# Altium schematic sheet Power Board.LDO.SchDoc
size A4; SheetNumber: 2; SheetTotal: 2
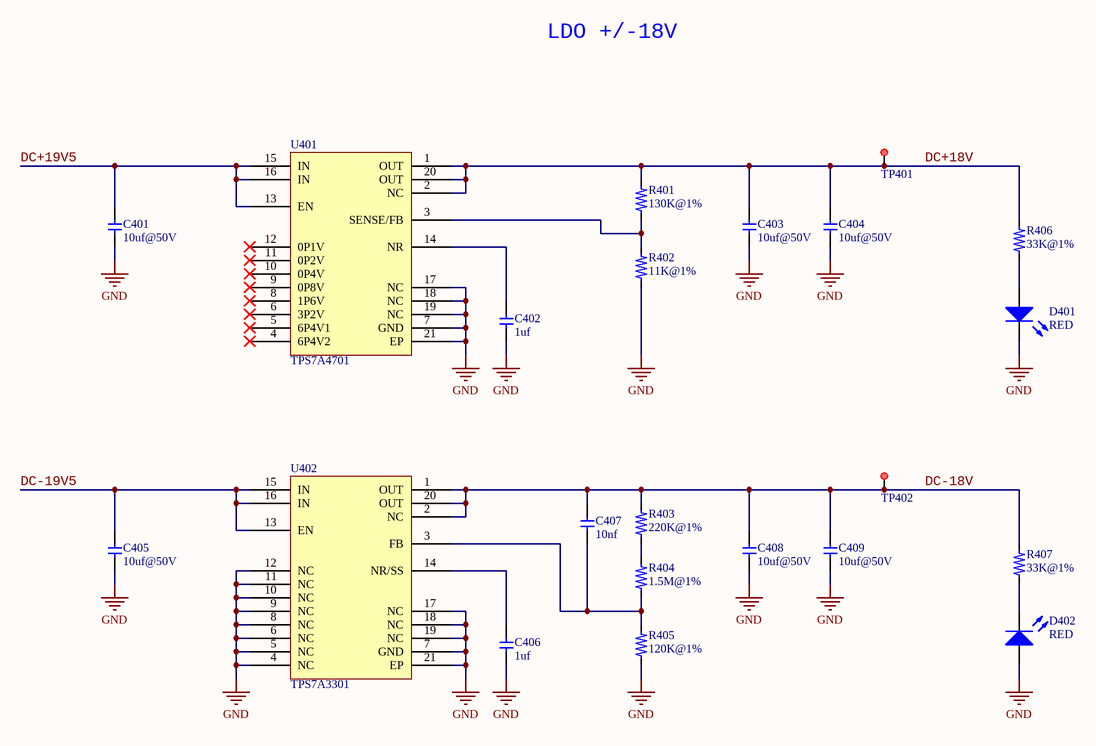
[diagram p0: Power Board.LDO.SchDoc]

## Parts
C401  value 10uf@50V  [C1206]  (hidden comment: Cap)
C402  value 1uf  [C0603]  (hidden comment: Cap)
C403  value 10uf@50V  [C1206]  (hidden comment: Cap)
C404  value 10uf@50V  [C1206]  (hidden comment: Cap)
C405  value 10uf@50V  [C1206]  (hidden comment: Cap)
C406  value 1uf  [C0603]  (hidden comment: Cap)
C407  value 10nf  [C0603]  (hidden comment: Cap)
C408  value 10uf@50V  [C1206]  (hidden comment: Cap)
C409  value 10uf@50V  [C1206]  (hidden comment: Cap)
D401  value RED  [LED0603]  (hidden comment: LED)
D402  value RED  [LED0603]  (hidden comment: LED)
R401  value 130K@1%  [R0603]  (hidden comment: Res)
R402  value 11K@1%  [R0603]  (hidden comment: Res)
R403  value 220K@1%  [R0603]  (hidden comment: Res)
R404  value 1.5M@1%  [R0603]  (hidden comment: Res)
R405  value 120K@1%  [R0603]  (hidden comment: Res)
R406  value 33K@1%  [R0603]  (hidden comment: Res)
R407  value 33K@1%  [R0603]  (hidden comment: Res)
TP401  TestPoint  [TestPoint-THM1.0-L]  (value not drawn)
TP402  TestPoint  [TestPoint-THM1.0-L]  (value not drawn)
U401  TPS7A4701  [TPS7A4701-QFN20]
U402  TPS7A3301  [TPS7A3301-QFN20]

## Nets
GND: C401.1 C402.2 C403.1 C404.1 C405.1 C406.2 C408.1 C409.1 D401.2(K) D402.1(A) R402.1 R405.1 U401.7(GND) U401.17(NC) U401.18(NC) U401.19(NC) U401.21(EP) U402.4(NC) U402.5(NC) U402.6(NC) U402.7(GND) U402.8(NC) U402.9(NC) U402.10(NC) U402.11(NC) U402.12(NC) U402.17(NC) U402.18(NC) U402.19(NC) U402.21(EP)
DC+18V: C403.2 C404.2 R401.2 R406.2 TP401.1 U401.1(OUT) U401.2(NC) U401.20(OUT)
DC+19V5: C401.2 U401.13(EN) U401.15(IN) U401.16(IN)
DC-18V: C407.2 C408.2 C409.2 R403.2 R407.2 TP402.1 U402.1(OUT) U402.2(NC) U402.20(OUT)
DC-19V5: C405.2 U402.13(EN) U402.15(IN) U402.16(IN)
NetC402_1: C402.1 U401.14(NR)
NetC406_1: C406.1 U402.14(NR/SS)
NetC407_1: C407.1 R404.1 R405.2 U402.3(FB)
NetD401_1: D401.1(A) R406.1
NetD402_2: D402.2(K) R407.1
NetR401_1: R401.1 R402.2 U401.3(SENSE/FB)
NetR403_1: R403.1 R404.2

Not connected (* = marked no-connect by the designer): U401 4(6P4V2)* 5(6P4V1)* 6(3P2V)* 8(1P6V)* 9(0P8V)* 10(0P4V)* 11(0P2V)* 12(0P1V)*

## Notes on the sheet
- LDO +/-18V

## Library data of the parts
R401-R407 = Res: 电阻
TP401 TP402 = TestPoint: 测试点
U401 = TPS7A4701: TPS7A470x 36-V, 1-A, 4-µVRMS, RF LDO Voltage Regulator
U402 = TPS7A3301: TPS7A33 –36-V, 1-A, Ultralow-Noise Negative Voltage Regulator